# Altium schematic sheet Thermit.SchDoc
size A
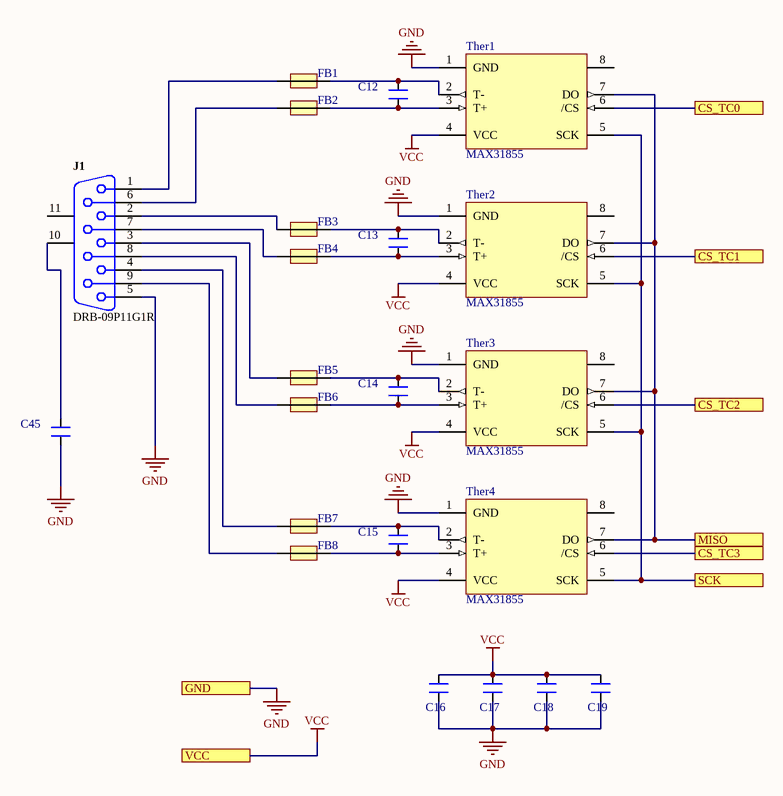
[diagram p0: Thermit.SchDoc]

## Parts
C12  10nF  [CN-SMD-0603_big]  (value not drawn)
C13  10nF  [CN-SMD-0603_big]  (value not drawn)
C14  10nF  [CN-SMD-0603_big]  (value not drawn)
C15  10nF  [CN-SMD-0603_big]  (value not drawn)
C16  100nF  [CN-SMD-0603_big]  (value not drawn)
C17  100nF  [CN-SMD-0603_big]  (value not drawn)
C18  100nF  [CN-SMD-0603_big]  (value not drawn)
C19  100nF  [CN-SMD-0603_big]  (value not drawn)
C45  10nF  [CN-SMD-0603_big]  (value not drawn)
FB1  FB  [Capacitor_805]  (value not drawn)
FB2  FB  [Capacitor_805]  (value not drawn)
FB3  FB  [Capacitor_805]  (value not drawn)
FB4  FB  [Capacitor_805]  (value not drawn)
FB5  FB  [Capacitor_805]  (value not drawn)
FB6  FB  [Capacitor_805]  (value not drawn)
FB7  FB  [Capacitor_805]  (value not drawn)
FB8  FB  [Capacitor_805]  (value not drawn)
J1  DRB-09P11G1R  [DB9_MALE]
Ther1  MAX31855  [SO8]
Ther2  MAX31855  [SO8]
Ther3  MAX31855  [SO8]
Ther4  MAX31855  [SO8]

## Ports
CS_TC0, CS_TC1, CS_TC2, CS_TC3, GND, MISO, SCK, VCC

## Nets
GND: C16.1 C17.1 C18.1 C19.1 C45.1 J1.5 Ther1.1(GND) Ther2.1(GND) Ther3.1(GND) Ther4.1(GND) ; port GND
VCC: C16.2 C17.2 C18.2 C19.2 Ther1.4(VCC) Ther2.4(VCC) Ther3.4(VCC) Ther4.4(VCC) ; port VCC
CS_TC0: Ther1.6(/CS) ; port CS_TC0
CS_TC1: Ther2.6(/CS) ; port CS_TC1
CS_TC2: Ther3.6(/CS) ; port CS_TC2
CS_TC3: Ther4.6(/CS) ; port CS_TC3
MISO: Ther1.7(DO) Ther2.7(DO) Ther3.7(DO) Ther4.7(DO) ; port MISO
SCK: Ther1.5(SCK) Ther2.5(SCK) Ther3.5(SCK) Ther4.5(SCK) ; port SCK
NetC12_1: C12.1 FB2.2 Ther1.3(T+)
NetC12_2: C12.2 FB1.2 Ther1.2(T-)
NetC13_1: C13.1 FB4.2 Ther2.3(T+)
NetC13_2: C13.2 FB3.2 Ther2.2(T-)
NetC14_1: C14.1 FB6.2 Ther3.3(T+)
NetC14_2: C14.2 FB5.2 Ther3.2(T-)
NetC15_1: C15.1 FB8.2 Ther4.3(T+)
NetC15_2: C15.2 FB7.2 Ther4.2(T-)
NetC45_2: C45.2 J1.10(MH1)
NetFB1_1: FB1.1 J1.1
NetFB2_1: FB2.1 J1.6
NetFB3_1: FB3.1 J1.2
NetFB4_1: FB4.1 J1.7
NetFB5_1: FB5.1 J1.3
NetFB6_1: FB6.1 J1.8
NetFB7_1: FB7.1 J1.4
NetFB8_1: FB8.1 J1.9

Not connected (* = marked no-connect by the designer): J1 11(MH2); Ther1 8; Ther2 8; Ther3 8; Ther4 8

## Library data of the parts
C12-C19 C45 = CN: Value: 33pF
J1 = CON 9 Male: Connector, DB9 R/A Through-hole Male; Connector type: Header; Max Current: 3A; Mounting Technology: Through-Hole; Pin Count: 9; Status: Unreleased; Category: Connector
Ther1-Ther4 = MAX31855: ComponentLink1Description: ADUM1201; ComponentLink1URL: https://thegioiic.com/products/adum1201arz